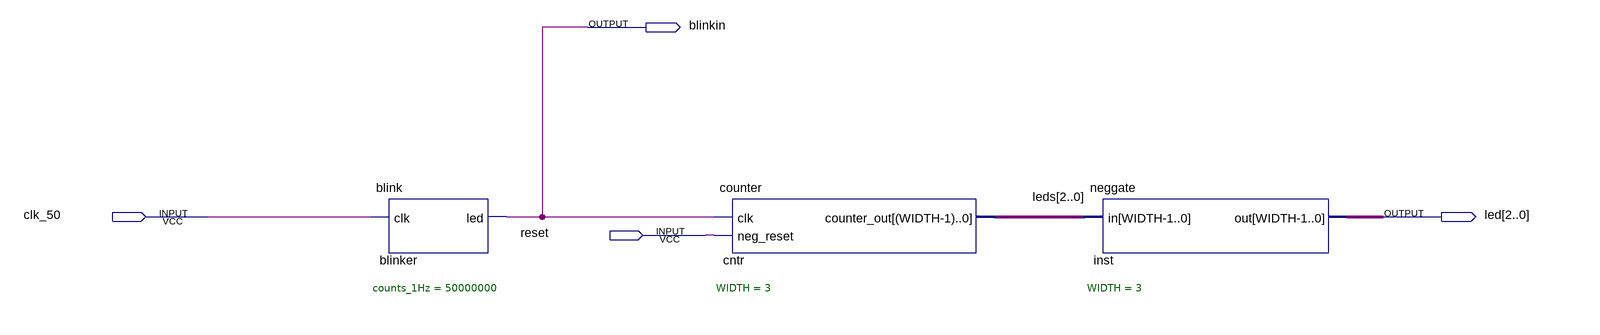
[diagram p0: schematic sheet]
// Quartus schematic demo.bdf as structural Verilog: 3 symbols, 4 pins
module demo (
  input  clk_50,
  input  reset,
  output blinkin,
  output [2:0] led
);

  wire [2:0] leds;

  blink #(.counts_1Hz(50000000)) blinker (.clk(clk_50), .led(blinkin));
  counter #(.WIDTH(3)) cntr (.clk(blinkin), .neg_reset(reset), .counter_out(leds));
  neggate #(.WIDTH(3)) inst (.in(leds), .out(led));
endmodule
